# EasyEDA schematic SCH_usb-hub_2024-06-19.json
TITLE: Sheet_1; REV: 1.0; Date: 2024-06-19; Sheet: 1/1; Drawn By: chardynamics; Company: Your Company
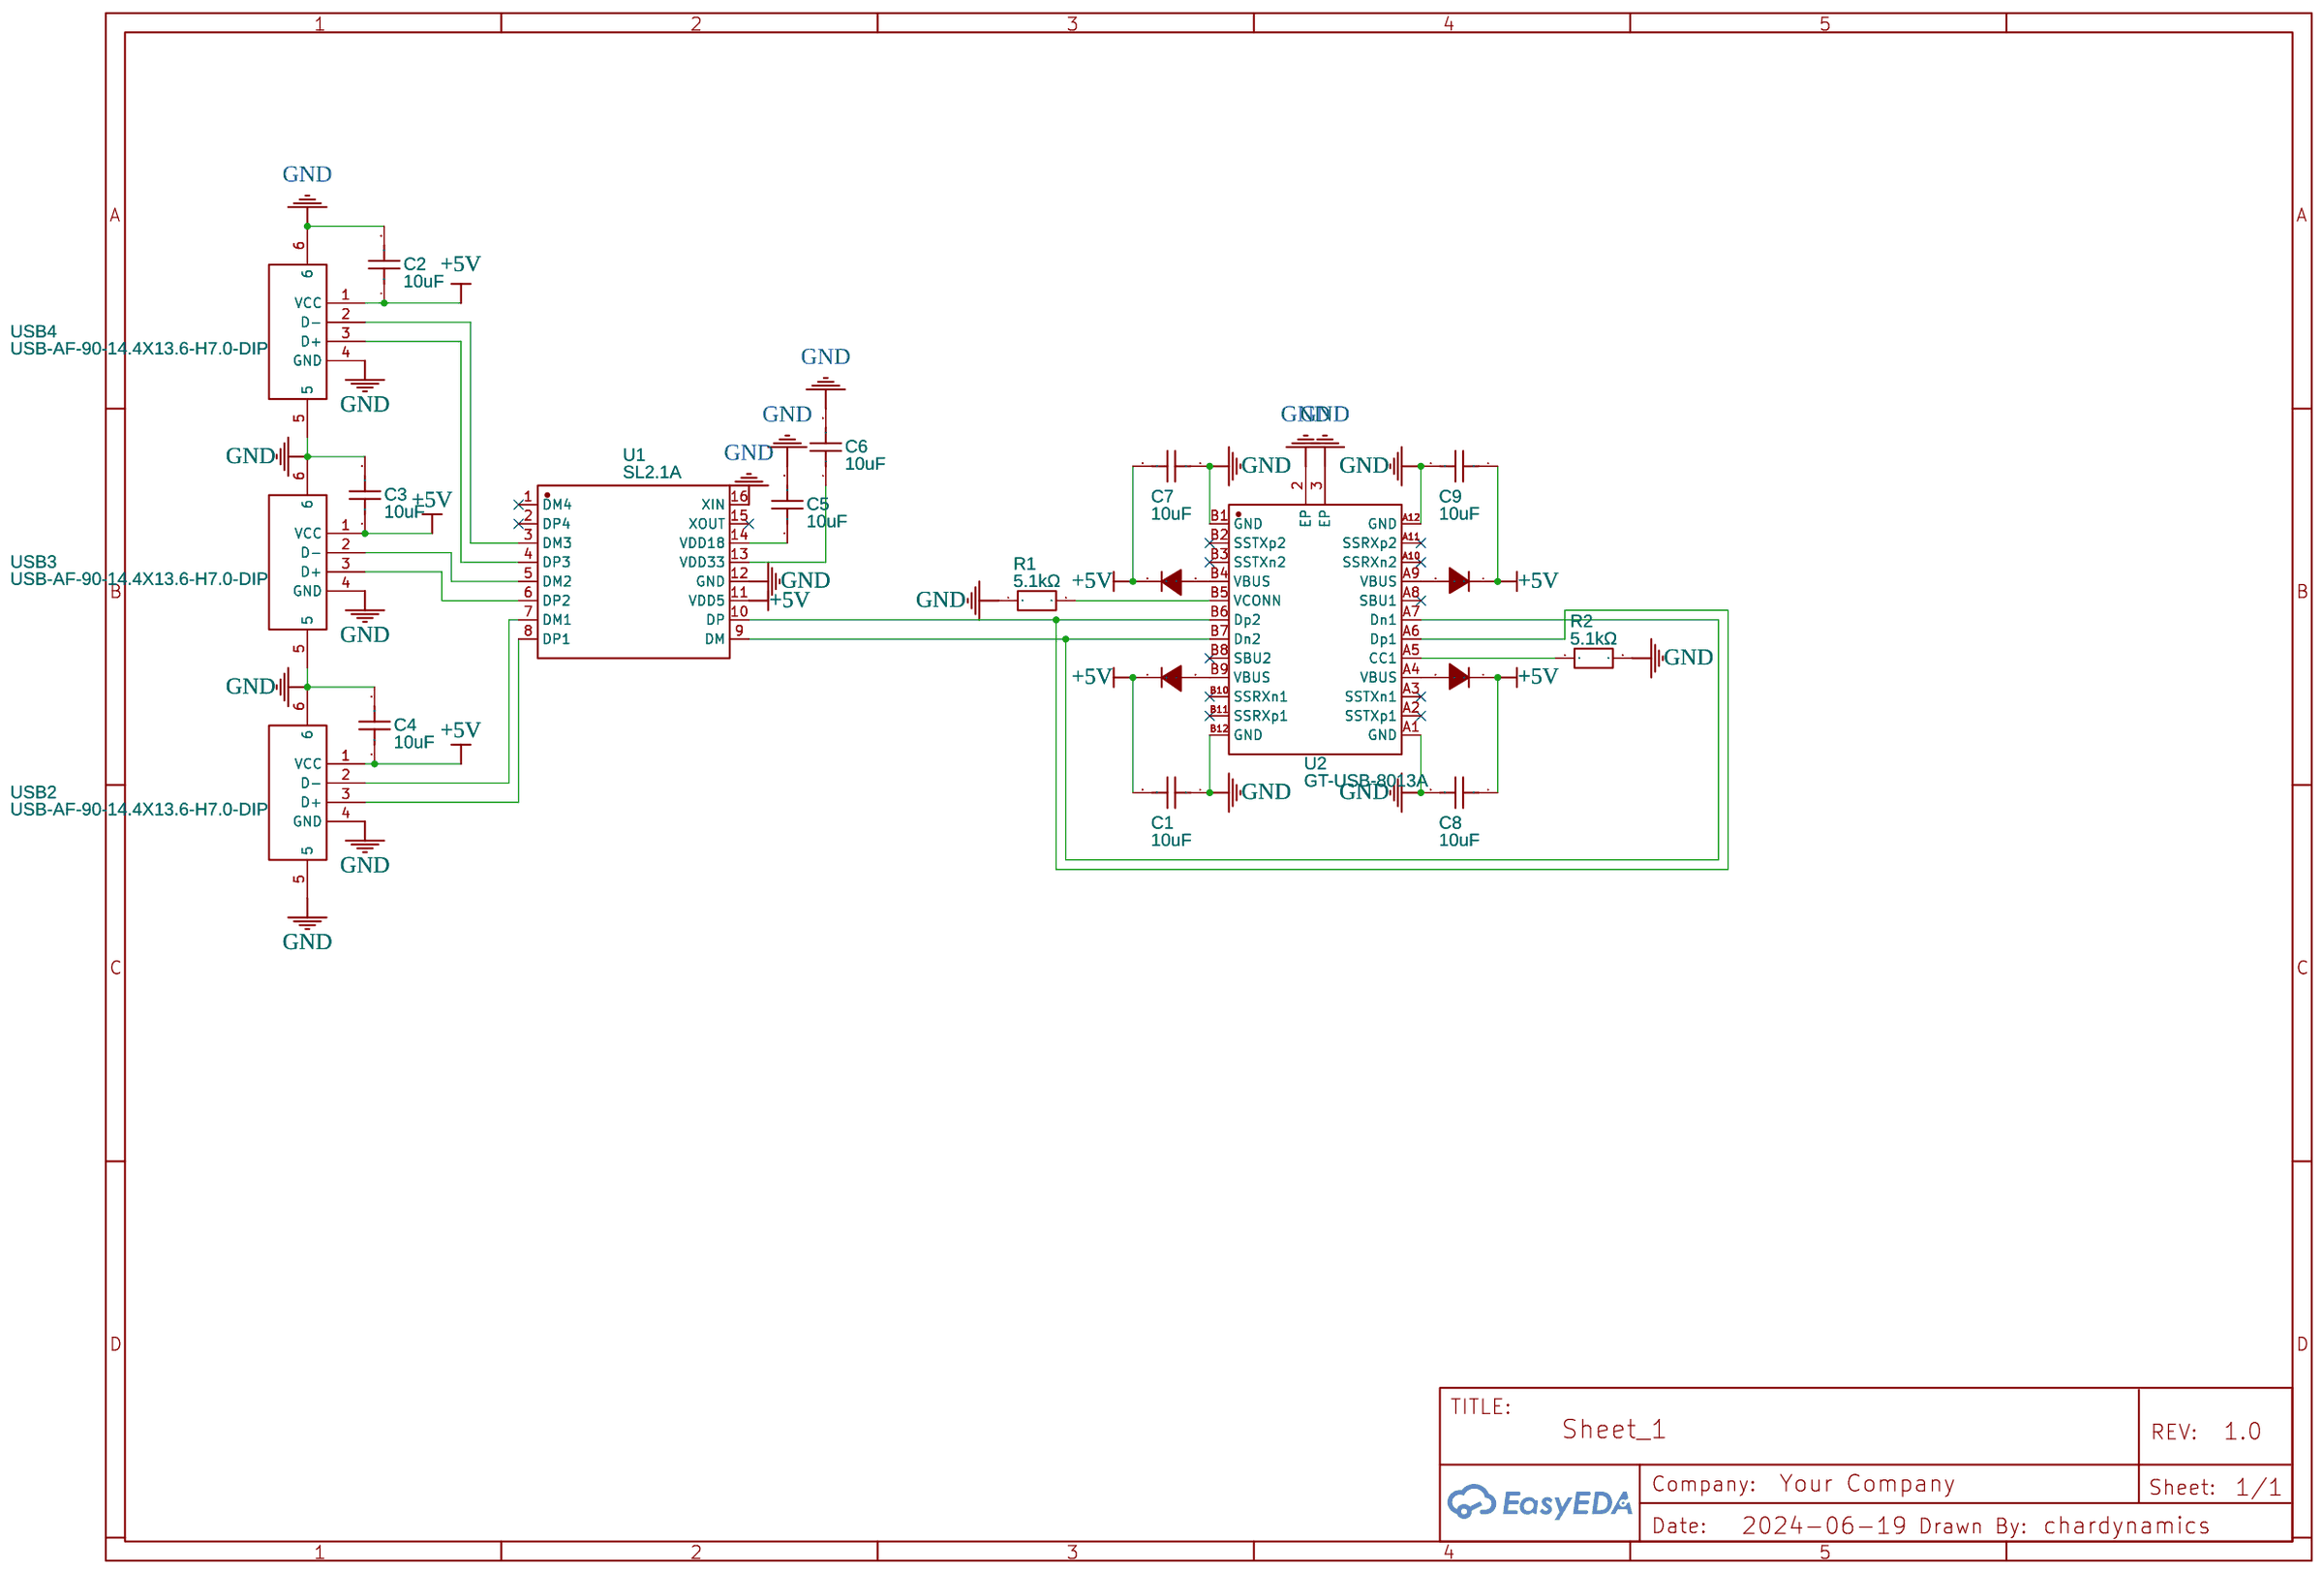
[diagram p0: schematic sheet]

## Parts
C1  10uF  [C0603]
C2  10uF  [C0603]
C3  10uF  [C0603]
C4  10uF  [C0603]
C5  10uF  [C0603]
C6  10uF  [C0603]
C7  10uF  [C0603]
C8  10uF  [C0603]
C9  10uF  [C0603]
D1  NSR0320MW2T1G  [SOD-323_L1.8-W1.3-LS2.5-RD]
D2  NSR0320MW2T1G  [SOD-323_L1.8-W1.3-LS2.5-RD]
D3  NSR0320MW2T1G  [SOD-323_L1.8-W1.3-LS2.5-RD]
D4  NSR0320MW2T1G  [SOD-323_L1.8-W1.3-LS2.5-RD]
R1  5.1kΩ  [R2010]
R2  5.1kΩ  [R2010]
U1  SL2.1A  [SOP-16_L10.0-W3.9-P1.27-LS6.0-BL]
U2  GT-USB-8013A  [USB-C-SMD_GT-USB-8013A]
USB2  USB-AF-90-14.4X13.6-H7.0-DIP  [USB-A-TH_C46407]
USB3  USB-AF-90-14.4X13.6-H7.0-DIP  [USB-A-TH_C46407]
USB4  USB-AF-90-14.4X13.6-H7.0-DIP  [USB-A-TH_C46407]

## Library data of the parts
C1-C9 = CL10A106KP8NNNC: Supplier: LCSC; Manufacturer: SAMSUNG(三星); Supplier Part: C19702; JLCPCB Part Class: Basic Part
D1-D4 = NSR0320MW2T1G: Supplier: LCSC; Manufacturer: onsemi(安森美); Supplier Part: C48192; JLCPCB Part Class: Extended Part
R1 R2 = RTT205101FTE: Contributor: LCSC; Supplier: LCSC; Supplier Part: C458637; Manufacturer: RALEC(旺诠); JLCPCB Part Class: Extended Part
U1 = SL2.1A: Contributor: LCSC; Supplier: LCSC; Supplier Part: C192893; Manufacturer: CoreChips(和芯润德); JLCPCB Part Class: Extended Part
U2 = GT-USB-8013A: Supplier: LCSC; Supplier Part: C2988370; Manufacturer: G-Switch(品赞); Contributor: lcsc; JLCPCB Part Class: Extended Part
USB2-USB4 = USB-AF-90-14.4X13.6-H7.0-DIP: Contributor: LCSC; Supplier: LCSC; Supplier Part: C46407; Manufacturer: 精拓金; Manufacturer Part: 903-131A1011D10100; JLCPCB Part Class: Extended Part

## Nets
+5V: C1.2 C2.1 C3.1 C4.1 C7.2 C8.1 C9.1 D1.1(C) D2.1(C) D3.1(C) D4.1(C) U1.11(VDD5) USB2.1(VCC) USB3.1(VCC) USB4.1(VCC)
GND: C1.1 C2.2 C3.2 C4.2 C5.2 C6.2 C7.1 C8.2 C9.2 R1.1 R2.2 U1.12(GND) U1.16(XIN) U2.2(EP) U2.3(EP) U2.A1(GND) U2.A12(GND) U2.B1(GND) U2.B12(GND) USB2.4(GND) USB2.5 USB2.6 USB3.4(GND) USB3.5 USB3.6 USB4.4(GND) USB4.5 USB4.6
Net-(C5-1): C5.1 U1.14(VDD18)
Net-(C6-1): C6.1 U1.13(VDD33)
Net-(D1-2): D1.2(A) U2.B9(VBUS)
Net-(D2-2): D2.2(A) U2.A9(VBUS)
Net-(D3-2): D3.2(A) U2.A4(VBUS)
Net-(D4-2): D4.2(A) U2.B4(VBUS)
Net-(R1-2): R1.2 U2.B5(VCONN)
Net-(R2-1): R2.1 U2.A5(CC1)
Net-(U1-3): U1.3(DM3) USB4.2(D-)
Net-(U1-4): U1.4(DP3) USB4.3(D+)
Net-(U1-5): U1.5(DM2) USB3.2(D-)
Net-(U1-6): U1.6(DP2) USB3.3(D+)
Net-(U1-7): U1.7(DM1) USB2.2(D-)
Net-(U1-8): U1.8(DP1) USB2.3(D+)
Net-(U1-9): U1.9(DM) U2.A7(Dn1) U2.B7(Dn2)
Net-(U1-10): U1.10(DP) U2.A6(Dp1) U2.B6(Dp2)

Not connected (* = marked no-connect by the designer): U1 1(DM4)* 2(DP4)* 15(XOUT)*; U2 A2(SSTXp1)* A3(SSTXn1)* A8(SBU1)* A10(SSRXn2)* A11(SSRXp2)* B2(SSTXp2)* B3(SSTXn2)* B8(SBU2)* B10(SSRXn1)* B11(SSRXp1)*
